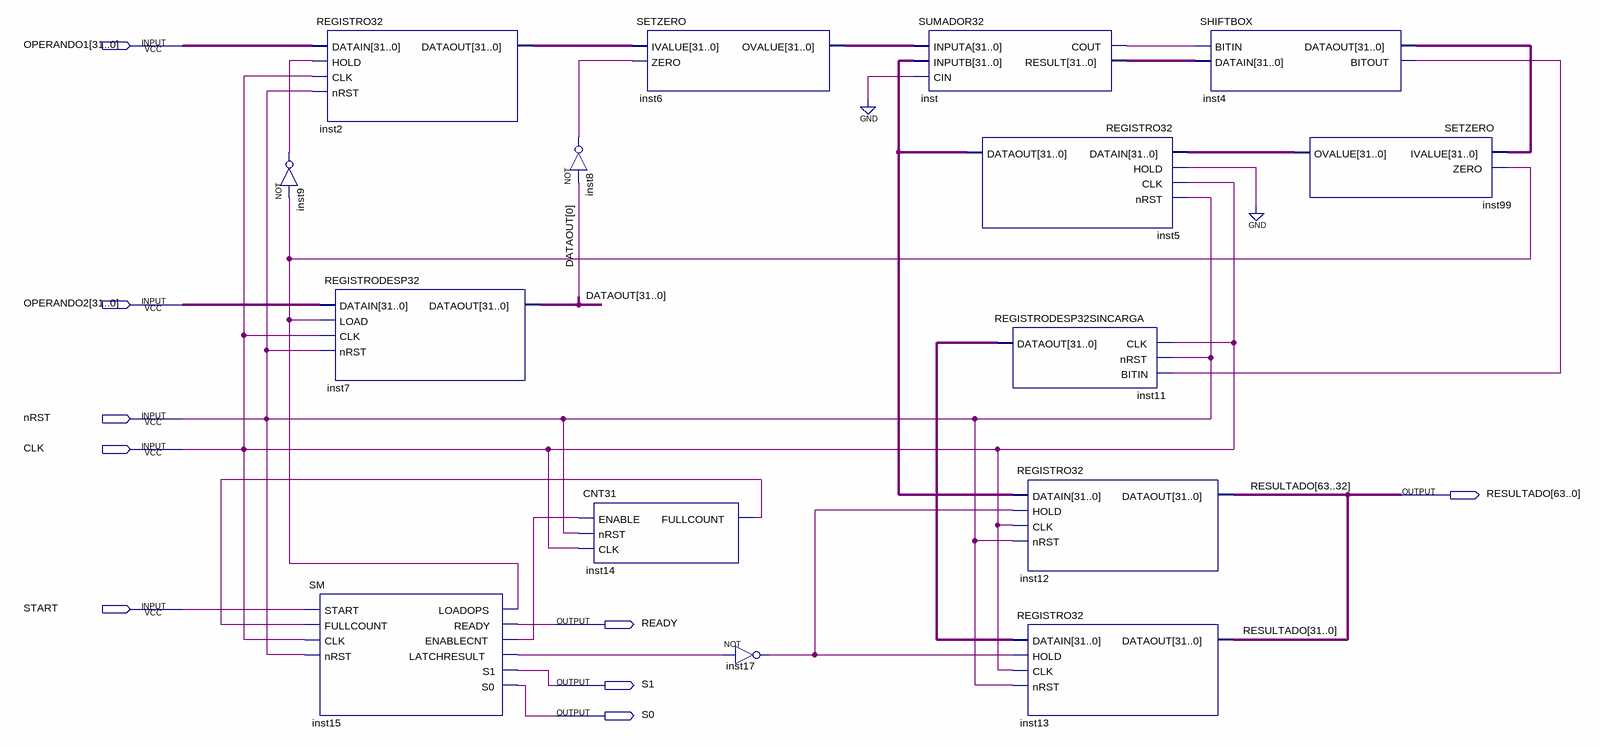
[diagram p0: schematic sheet]
// Quartus schematic MULTIPLICADORSECUENCIAL.bdf as structural Verilog: 15 symbols, 9 pins
module MULTIPLICADORSECUENCIAL (
  input  [31:0] OPERANDO1,
  input  [31:0] OPERANDO2,
  input  nRST,
  input  CLK,
  input  START,
  output [63:0] RESULTADO,
  output READY,
  output S1,
  output S0
);

  wire inst4_bitout, inst8_out, inst9_out, inst14_fullcount, inst15_enablecnt, inst15_latchresult,
       inst15_loadops, inst17_out, inst_cout;
  wire [31:0] DATAOUT, inst2_dataout, inst4_dataout, inst5_dataout, inst6_ovalue, inst11_dataout,
       inst99_ovalue, inst_result;

  not inst9 (inst9_out, inst15_loadops);
  REGISTRO32 inst2 (.DATAIN(OPERANDO1), .HOLD(inst9_out), .CLK(CLK), .nRST(nRST), .DATAOUT(inst2_dataout));
  REGISTRODESP32 inst7 (.DATAIN(OPERANDO2), .LOAD(inst15_loadops), .CLK(CLK), .nRST(nRST), .DATAOUT(DATAOUT));
  SM inst15 (
    .START(START), .FULLCOUNT(inst14_fullcount), .CLK(CLK), .nRST(nRST), .LOADOPS(inst15_loadops),
    .READY(READY), .ENABLECNT(inst15_enablecnt), .LATCHRESULT(inst15_latchresult), .S1(S1), .S0(S0));
  not inst8 (inst8_out, DATAOUT[0]);
  CNT31 inst14 (.ENABLE(inst15_enablecnt), .nRST(nRST), .CLK(CLK), .FULLCOUNT(inst14_fullcount));
  SETZERO inst6 (.IVALUE(inst2_dataout), .ZERO(inst8_out), .OVALUE(inst6_ovalue));
  not inst17 (inst17_out, inst15_latchresult);
  SUMADOR32 inst (.INPUTA(inst6_ovalue), .INPUTB(inst5_dataout), .CIN(1'b0), .COUT(inst_cout), .RESULT(inst_result));
  REGISTRO32 inst5 (.DATAIN(inst99_ovalue), .HOLD(1'b0), .CLK(CLK), .nRST(nRST), .DATAOUT(inst5_dataout));
  REGISTRODESP32SINCARGA inst11 (.CLK(CLK), .nRST(nRST), .BITIN(inst4_bitout), .DATAOUT(inst11_dataout));
  REGISTRO32 inst12 (.DATAIN(inst5_dataout), .HOLD(inst17_out), .CLK(CLK), .nRST(nRST), .DATAOUT(RESULTADO[63:32]));
  REGISTRO32 inst13 (.DATAIN(inst11_dataout), .HOLD(inst17_out), .CLK(CLK), .nRST(nRST), .DATAOUT(RESULTADO[31:0]));
  SHIFTBOX inst4 (.BITIN(inst_cout), .DATAIN(inst_result), .DATAOUT(inst4_dataout), .BITOUT(inst4_bitout));
  SETZERO inst99 (.IVALUE(inst4_dataout), .ZERO(inst15_loadops), .OVALUE(inst99_ovalue));
endmodule
